# EAGLE design controller (EAGLE 9.6.2)
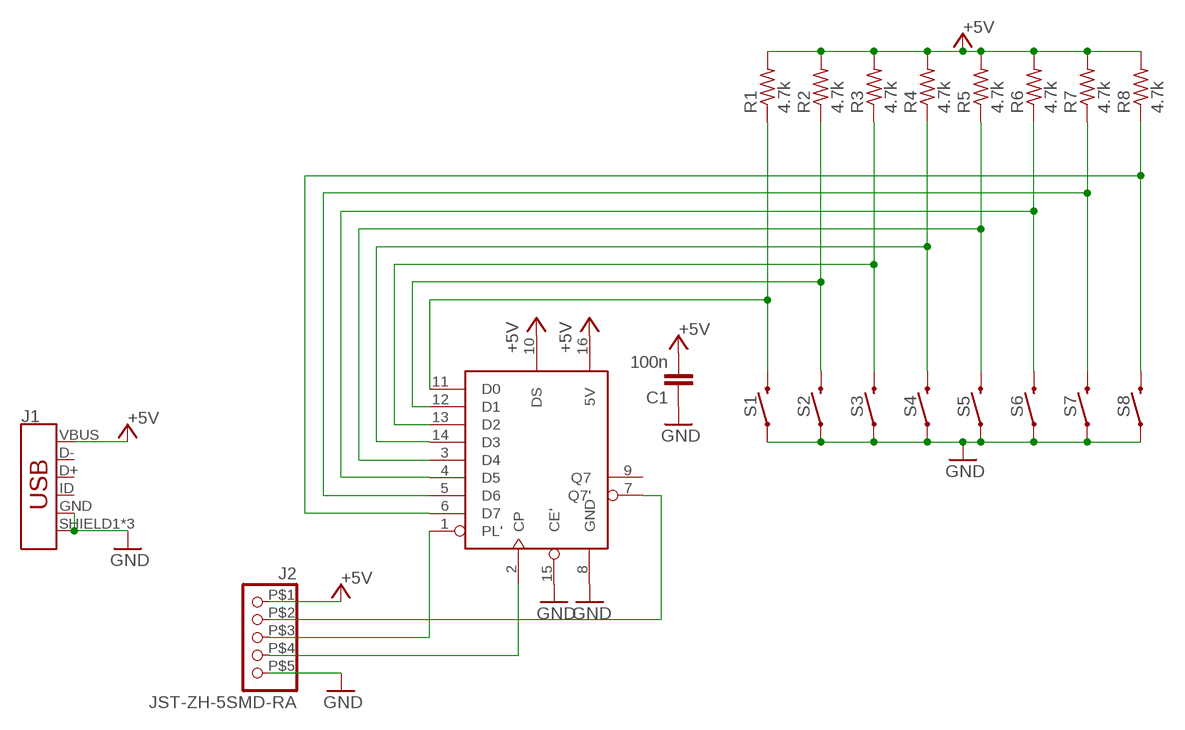
[diagram p0: schematic, sheet 1]

## Parts
C1  100n  C-EUC0603  [C0603]
J1  USB_MICRO-B_FEMALE-SMT  [USB-B-MICRO-SMD]
J2  JST-ZH-5SMD-RA  [JST-ZH-5-SMD-RA]
R1  4.7k  R-US_R0603  [R0603]
R2  4.7k  R-US_R0603  [R0603]
R3  4.7k  R-US_R0603  [R0603]
R4  4.7k  R-US_R0603  [R0603]
R5  4.7k  R-US_R0603  [R0603]
R6  4.7k  R-US_R0603  [R0603]
R7  4.7k  R-US_R0603  [R0603]
R8  4.7k  R-US_R0603  [R0603]
S1  MOMENTARY-SWITCH-SPST-SMD-6.0X3.5MM  [TACTILE_SWITCH_SMD_6.0X3.5MM]
S2  MOMENTARY-SWITCH-SPST-SMD-6.0X3.5MM  [TACTILE_SWITCH_SMD_6.0X3.5MM]
S3  MOMENTARY-SWITCH-SPST-SMD-6.0X3.5MM  [TACTILE_SWITCH_SMD_6.0X3.5MM]
S4  MOMENTARY-SWITCH-SPST-SMD-6.0X3.5MM  [TACTILE_SWITCH_SMD_6.0X3.5MM]
S5  MOMENTARY-SWITCH-SPST-SMD-6.0X3.5MM  [TACTILE_SWITCH_SMD_6.0X3.5MM]
S6  MOMENTARY-SWITCH-SPST-SMD-6.0X3.5MM  [TACTILE_SWITCH_SMD_6.0X3.5MM]
S7  MOMENTARY-SWITCH-SPST-SMD-6.0X3.5MM  [TACTILE_SWITCH_SMD_6.0X3.5MM]
S8  MOMENTARY-SWITCH-SPST-SMD-6.0X3.5MM  [TACTILE_SWITCH_SMD_6.0X3.5MM]
U1  74HCT165TSSOP16  [SOP65P640X110-16N]

## Nets
+5V: C1.2 J1.VBUS J2.P$1 R1.2 R2.2 R3.2 R4.2 R5.2 R6.2 R7.2 R8.2 U1.10(DS) U1.16(5V)
GND: C1.1 J1.GND J1.SHIELD1(SHIELD) J1.SHIELD2(SHIELD) J1.SHIELD3(SHIELD) J2.P$5 S1.1 S2.1 S3.1 S4.1 S5.1 S6.1 S7.1 S8.1 U1.8(GND) U1.15(CE')
N$1: J2.P$4 U1.2(CP)
N$2: J2.P$3 U1.1(PL')
N$3: J2.P$2 U1.7(Q7')
N$4: R1.1 S1.2 U1.11(D0)
N$5: R2.1 S2.2 U1.12(D1)
N$6: R3.1 S3.2 U1.13(D2)
N$7: R4.1 S4.2 U1.14(D3)
N$8: R5.1 S5.2 U1.3(D4)
N$9: R6.1 S6.2 U1.4(D5)
N$10: R7.1 S7.2 U1.5(D6)
N$11: R8.1 S8.2 U1.6(D7)
Unconnected: J1.D+ J1.D- J1.ID U1.9(Q7)

## Library data of the parts
C1 = rcl:C-EU: CAPACITOR, European symbol; SPICEPREFIX: C
J1 = SparkFun-Connectors:USB_MICRO-B: USB Type Micro-B Connector Male/female and PTH/SMT variants SparkFun Products: SparkFun microB USB Breakout <https://www.sparkfun.com/products/12035> SparkFun USB microB Plug Breakout <https://www.sparkfun.com/products/10031> SparkFun ESP8266 Thing <https://www.sparkfun.com/products/13231>; PROD_ID: CONN-11752
J2 = josh:JST-ZH-5
R1-R8 = rcl:R-US_: RESISTOR, American symbol; SPICEPREFIX: R
S1-S8 = SparkFun-Switches:MOMENTARY-SWITCH-SPST: Momentary Switch (Pushbutton) - SPST Normally-open (NO) SPST momentary switches (buttons, pushbuttons). Variants PTH-12MM - 12mm square, through-hole Momentary Pushbutton Switch - 12mm Square <https://www.sparkfun.com/products/9190> (COM-09190) PTH-6.0MM, PTH-6.0MM-KIT - 6.0mm square, through-hole Mini Pushbutton Switch <https://www.sparkfun.com/products/97> (COM-00097) KIT package intended for soldering kit's - only one side of pads' copper is exposed. PTH-RIGHT-ANGLE-KIT - Right-angle, through-hole Right Angle Tactile Button <https://www.sparkfun.com/products/10791> - Used on SparkFun BigTime Watch Kit <https://www.sparkfun.com/products/11734> SMD-12MM - 12mm square, surface-mount Tactile Button - SMD (12mm) <https://www.sparkfun.com/products/12993> (COM-12993) Used on SparkFun PicoBoard <https://www.sparkfun.com/products/11888> SMD-4.5MM - 4.5mm Square Trackball Switch Used on SparkFun Blackberry Trackballer Breakout <https://www.sparkfun.com/products/13169> SMD-4.6MMX2.8MM - 4.60mm x 2.80mm, surface mount Used on SparkFun SAMD21 Mini Breakout <https://www.sparkfun.com/products/13664> SMD-5.2MM, SMD-5.2-REDUNDANT - 5.2mm square, surface-mount Mini Pushbutton Switch - SMD <https://www.sparkfun.com/products/8720> (COM-08720) Used on Arduino Pro Mini <https://www.sparkfun.com/products/11114> REDUNDANT package connects both switch circuits together SMD-6.0X3.5MM - 6.0 x 3.5mm, surface mount Momentary Reset Switch SMD <https://www.sparkfun.com/products/8229> (COM-08229) SMD-6.2MM-TALL - 6.2mm square, surface mount Tactile Button - SMD (6mm) <https://www.sparkfun.com/products/12992> Used on SparkFun Digital Sandbox <https://www.sparkfun.com/products/12651> SMD-RIGHT-ANGLE - Right-angle, surface mount Used on SparkFun Block for Intel® Edison - Arduino <https://www.sparkfun.com/products/13036>; PROD_ID: SWCH-14278; SF_SKU: COM-08229
U1 = josh:74HCT165

## Board
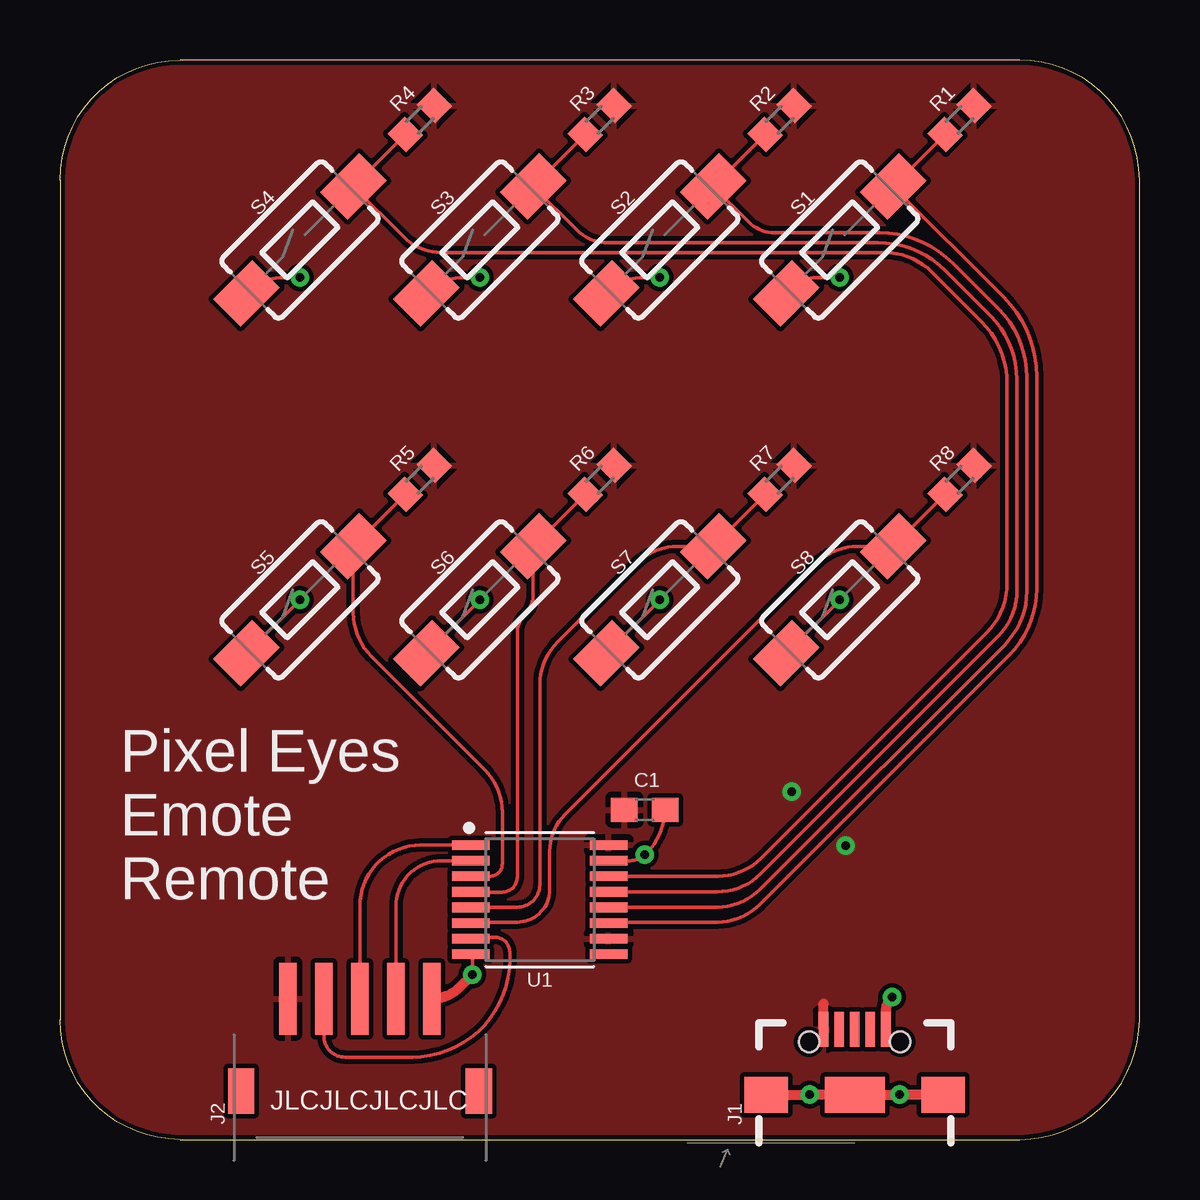
[diagram p1: board, top side]
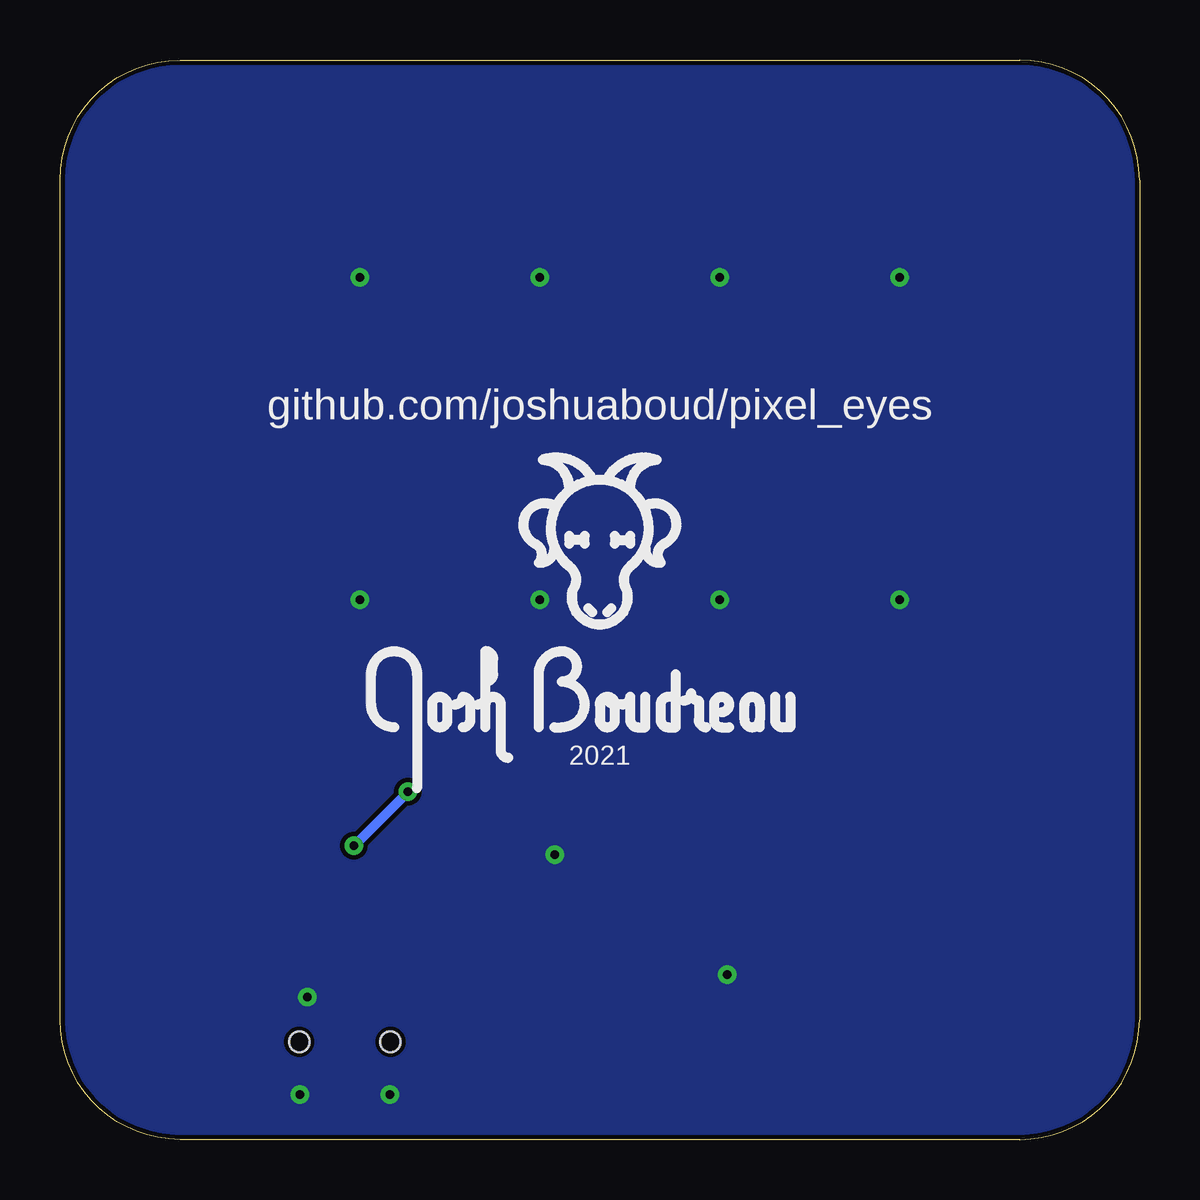
[diagram p2: board, bottom side, seen from below]

Size 45 x 45 mm. Coordinates in mm from the lower left corner, seen from the top.
Outline: 5,0 40,0 arc90 45,5 45,40 arc90 40,45 5,45 arc90 0,40 0,5 arc90 5,0
Copper layers (1*16): Top 0.035mm / dielectric 1.5mm / Bottom 0.035mm
Design rules "jlcpcb": minimum track width 5mil, minimum drill 0.35mm, track to track 0.2mm, track to pad 0.2mm, pad to pad 0.2mm, via to via 0.2mm, smd to smd 6mil, copper to edge 0.2mm, drill to drill 0.5mm, minimum pad ring 10mil, minimum via ring 8mil, stop-mask expansion 4mil, vias tented up to drill 0mil, thermal gap 10mil

### Footprints (pad centres in the part's own frame; a part is rotated, then mirrored left to right if it is on the bottom)
C0603 = smd 1.1 x 1: 1 -0.85,0; 2 0.85,0
USB-B-MICRO-SMD = smd 1.45 x 0.4: D+ 2.725,0; D- 2.725,0.65; GND 2.725,-1.3; ID 2.725,-0.65; VBUS 2.725,1.3 | smd 1.5 x 1.8: SHIELD1 0,3.685; SHIELD2 0,-3.685 | smd 1.5 x 2.5: SHIELD3 0,0 | hole 0.85: 2.2,1.9; 2.2,-1.9
JST-ZH-5-SMD-RA = smd 0.72 x 3: P$1 3,-1.5; P$2 1.5,-1.5; P$3 0,-1.5; P$4 -1.5,-1.5; P$5 -3,-1.5 | smd 1.1 x 1.9: P$6 4.95,2.35; P$7 -4.95,2.35
R0603 = smd 1 x 1.1: 1 -0.85,0; 2 0.85,0
TACTILE_SWITCH_SMD_6.0X3.5MM = smd 2.3 x 1.6: 1 -3.15,0; 2 3.15,0
SOP65P640X110-16N = smd 1.572 x 0.407: 1 -2.872,2.275; 2 -2.872,1.625; 3 -2.872,0.975; 4 -2.872,0.325; 5 -2.872,-0.325; 6 -2.872,-0.975; 7 -2.872,-1.625; 8 -2.872,-2.275; 9 2.872,-2.275; 10 2.872,-1.625; 11 2.872,-0.975; 12 2.872,-0.325; 13 2.872,0.325; 14 2.872,0.975; 15 2.872,1.625; 16 2.872,2.275

### Placement (x,y rotation side)
C1  24.38,13.75 180 top
J1  33.12,1.88 90 top
J2  12.5,4.38 180 top
R1  37.5,42.5 45 top
R2  30,42.5 45 top
R3  22.5,42.5 45 top
R4  15,42.5 45 top
R5  15,27.5 45 top
R6  22.5,27.5 45 top
R7  30,27.5 45 top
R8  37.5,27.5 45 top
S1  32.5,37.5 45 top
S2  25,37.5 45 top
S3  17.5,37.5 45 top
S4  10,37.5 45 top
S5  10,22.5 45 top
S6  17.5,22.5 45 top
S7  25,22.5 45 top
S8  32.5,22.5 45 top
U1  20,10 0 top
U$1  [SIGNATURE]  22.5,17.5 0 bottom
U$3  [LOGO_SILKSCREEN]  22.5,25 0 bottom

### Tracks (layer width: path | path; a pad name or v marks a point on that pad's centre or on a via)
+5V  (via drill 0.35)
  Top 0.406: J1.VBUS 31.82,5.67
  Bottom 0.406: v30.5,14.5 v32.75,12.25
  pour Top: 0,-5 0,50 25,50 45,50 45,-5
GND  (via drill 0.35)
  Top 0.152: S5.1 v10,22.5 | S6.1 v17.5,22.5 | S7.1 v25,22.5 | S8.1 v32.5,22.5 | S3.1 arc-45 16.88,35.94 v17.5,35.94 | S2.1 arc-45 24.38,35.94 v25,35.94 | S1.1 30.51,35.51 arc-45 31.55,35.94 v32.5,35.94 | S4.1 arc-45 9.38,35.94 v10,35.94 | U1.8 arc-45 17.19,7.58 v17.19,6.88 | U1.15 23.77,11.62 arc45 v24.38,11.88 24.48,11.98 arc45 25.21,13.73 C1.1
  Top 0.406: J2.P$5 arc45 16.67,6.36 v17.19,6.88 | J1.GND 34.42,5.3 arc-45 v34.69,5.94 | J1.SHIELD1 v31.25,1.88 J1.SHIELD3 v35,1.88 J1.SHIELD2
  pour Bottom: 0,-5 0,50 45,50 45,-5
N$1
  Top 0.152: J2.P$4 14,9.71 arc-90 15.91,11.62 U1.2
N$2
  Top 0.152: J2.P$3 12.5,9.73 arc-90 15.04,12.28 U1.1
N$3
  Top 0.152: J2.P$2 11,4.31 arc90 11.88,3.44 14.69,3.44 arc90 18.75,7.5 18.75,7.81 arc90 18.12,8.44 17.19,8.44 arc90 U1.7
N$4
  Top 0.152: R1.1 S1.2 39.35,35.11 arc-45 40.71,31.81 40.71,22.95 arc-45 39.57,20.19 29.18,9.81 arc-45 27.39,9.06 22.96,9.06 arc45 U1.11
N$5
  Top 0.152: R2.1 S2.2 28.71,38.24 arc45 29.78,37.8 34.16,37.8 arc-45 37.22,36.53 39.12,34.63 arc-45 40.3,31.78 40.3,22.86 arc-45 39.38,20.62 29.18,10.43 arc-45 27.39,9.69 22.9,9.69 arc45 U1.12
N$6
  Top 0.152: U1.13 27.4,10.32 arc45 29.19,11.07 39.12,20.99 arc45 39.89,22.86 39.89,31.69 arc45 38.79,34.33 36.9,36.22 arc45 34.09,37.39 22.84,37.39 arc-45 21.52,37.93 S3.2 R3.1
N$7
  Top 0.152: U1.14 27.42,10.97 arc45 29.22,11.72 38.63,21.13 arc45 39.48,23.17 39.48,31.52 arc45 38.41,34.09 36.35,36.15 arc45 34.36,36.98 15.89,36.98 arc-45 14.34,37.62 S4.2 R4.1
N$8
  Top 0.152: R5.1 S5.2 12.23,21.95 arc45 12.97,20.15 17.69,15.43 arc-45 18.44,13.63 18.44,11.49 arc-90 17.93,10.97 U1.3
N$9
  Top 0.152: R6.1 S6.2 19.73,22.73 arc-45 19.38,21.88 arc45 19.06,21.12 19.06,10.94 arc-90 18.44,10.31 U1.4 arc-90 U1.4
N$10
  Top 0.152: R7.1 S7.2 25.78,24.73 arc45 23.98,23.98 20.74,20.74 arc45 20,18.95 20,10.62 arc-90 19.06,9.69 U1.5 arc90 U1.5
N$11
  Top 0.152: R8.1 S8.2 33.28,24.73 arc45 31.48,23.98 21.06,13.56 arc45 20.41,12 20.41,10.41 arc-90 19.06,9.06 17.17,9.06 arc90 U1.6

### Text on the board
tNames: Pixel Eyes / Emote / Remote | J2 | JLCJLCJLCJLC
bNames: github.com/joshuaboud/pixel_eyes | 2021